# Altium project Kasli.PrjPCB (part 6 of 6)

## Sheet USB_Serial_Quad.SchDoc: =ProjectName
size 420 x 297 mm; Author: Paweł Kulik; DrawnBy: Paweł Kulik; Address1: Warsaw Univeristy of Technology; Address2: Nowowiejska 15/19; DocumentNumber: 12; Revision: 2.0; SheetNumber: 10; SheetTotal: 11; EDA_Number: ARTIQ; Projet: ARTIQ/SINARA; ModifiedBy: -; CheckedDate: -; Title2: USB_Serial_Quad.SchDoc; DivGrp: ISE; Designer: Paweł Kulik; ProjectName: ARTIQ/SINARA
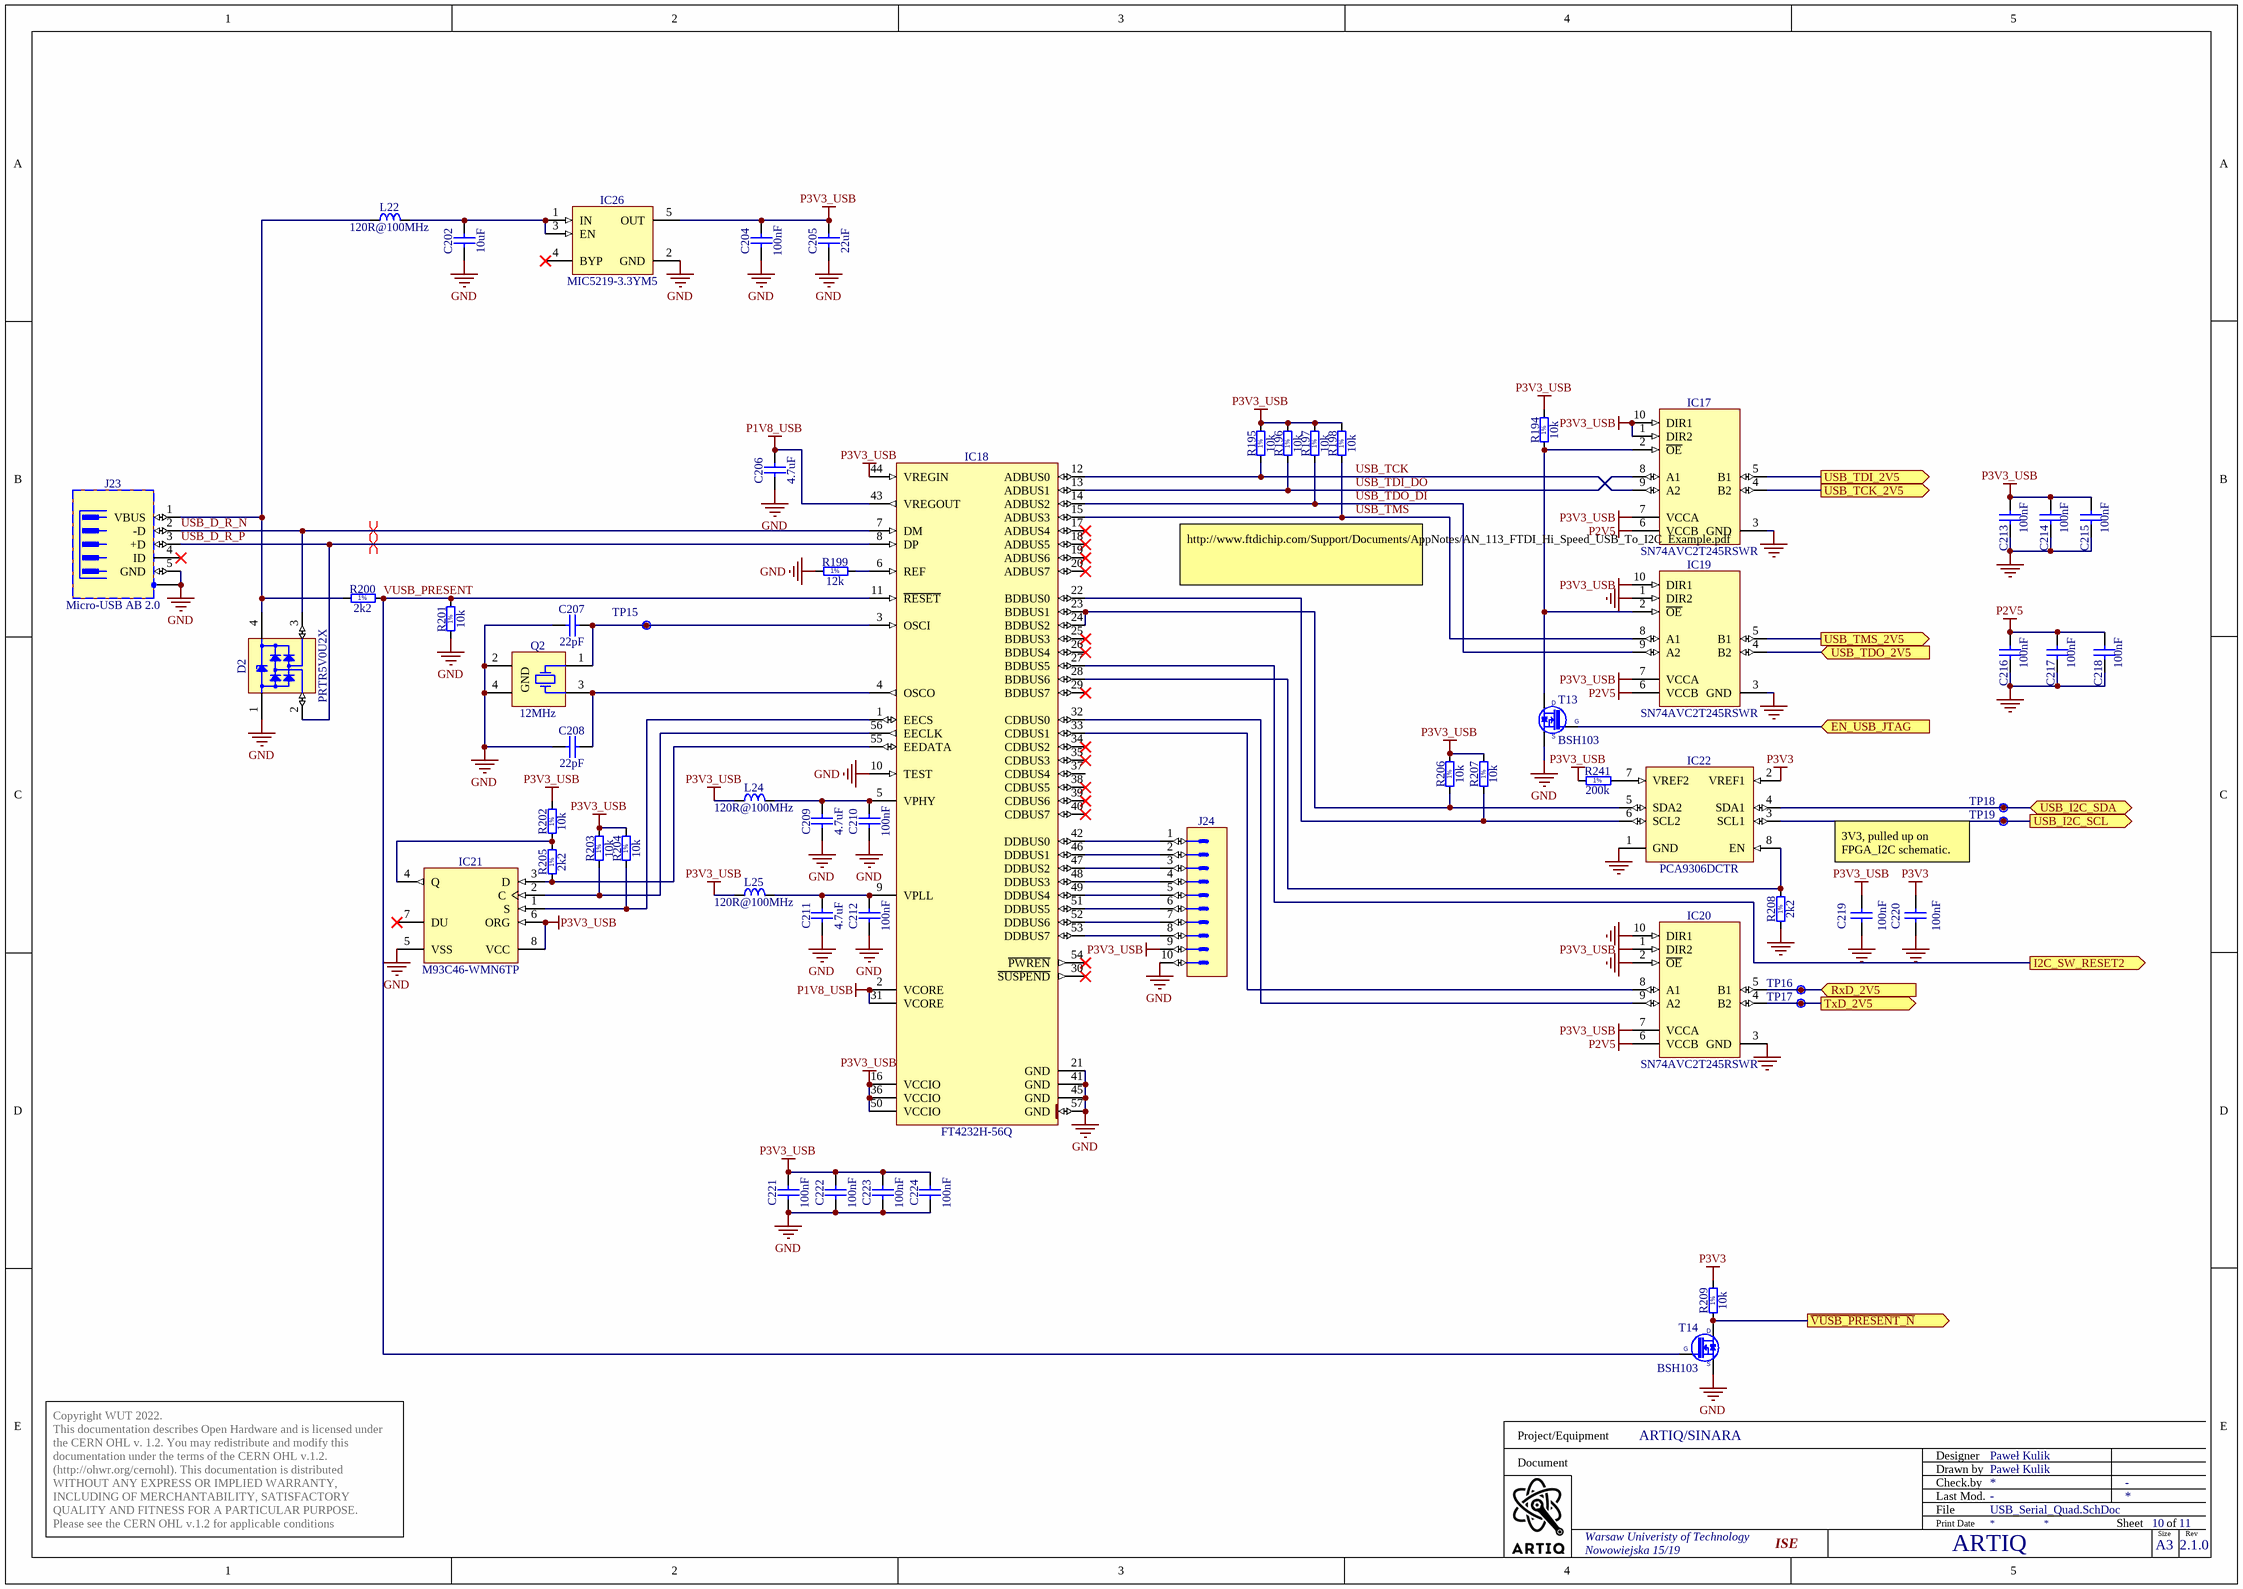
[diagram p10: USB_Serial_Quad.SchDoc]

### Parts
C202  10uF  [CAPC1608X87N]
C204  100nF  [CAPC0603X33N]
C205  22uF  [CAPC1709X100N]
C206  4.7uF  [CAPC2012X135N]
C207  22pF  [CAPC1005X55N]
C208  22pF  [CAPC1005X55N]
C209  4.7uF  [CAPC2012X135N]
C210  100nF  [CAPC0603X33N]
C211  4.7uF  [CAPC2012X135N]
C212  100nF  [CAPC0603X33N]
C213  100nF  [CAPC0603X33N]
C214  100nF  [CAPC0603X33N]
C215  100nF  [CAPC0603X33N]
C216  100nF  [CAPC0603X33N]
C217  100nF  [CAPC0603X33N]
C218  100nF  [CAPC0603X33N]
C219  100nF  [CAPC0603X33N]
C220  100nF  [CAPC0603X33N]
C221  100nF  [CAPC0603X33N]
C222  100nF  [CAPC0603X33N]
C223  100nF  [CAPC0603X33N]
C224  100nF  [CAPC0603X33N]
D2  PRTR5V0U2X  [SOT190P230X110-4N]
IC17  SN74AVC2T245RSWR  [QFN40P140X180X55-10N]
IC18  FT4232H-56Q  [QFN50P800X800X100-57N-S620]
IC19  SN74AVC2T245RSWR  [QFN40P140X180X55-10N]
IC20  SN74AVC2T245RSWR  [QFN40P140X180X55-10N]
IC21  M93C46-WMN6TP  [SOIC127P600X175-8N]
IC22  PCA9306DCTR  [SOP65P400X130-8N]
IC26  MIC5219-3.3YM5  [SOT95P280X145-5N]
J23  Micro-USB AB 2.0  [HIROSE_ZX62RD-AB-5P8]
J24  Header 10  [SAMTEC_TSW-105-07-L-D-LL]  (value not drawn)
L22  120R@100MHz  [INDC1608X65N]
L24  120R@100MHz  [INDC1608X65N]
L25  120R@100MHz  [INDC1608X65N]
Q2  12MHz  [XTAL_TXC_7M]
R194  10k  [RESC1005X40N]
R195  10k  [RESC1005X40N]
R196  10k  [RESC1005X40N]
R197  10k  [RESC1005X40N]
R198  10k  [RESC1005X40N]
R199  12k  [RESC1005X40N]
R200  2k2  [RESC1005X40N]
R201  10k  [RESC1005X40N]
R202  10k  [RESC1005X40N]
R203  10k  [RESC1005X40N]
R204  10k  [RESC1005X40N]
R205  2k2  [RESC1005X40N]
R206  10k  [RESC1005X40N]
R207  10k  [RESC1005X40N]
R208  2k2  [RESC1005X40N]
R209  10k  [RESC1005X40N]
R241  200k  [RESC1005X40N]
T13  BSH103  [SOT95P230X110-3N]
T14  BSH103  [SOT95P230X110-3N]
TP15  Q2  [TPS127]  (value not drawn)
TP16  RxD  [TPS127]  (value not drawn)
TP17  TxD  [TPS127]  (value not drawn)
TP18  USB I2C SDA  [TPS127]  (value not drawn)
TP19  USB I2C SCL  [TPS127]  (value not drawn)

### Ports
EN_USB_JTAG (in), I2C_SW_RESET2 (out), RxD_2V5 (in), TxD_2V5 (out), USB_I2C_SCL (out), USB_I2C_SDA (bidir), USB_TCK_2V5 (out), USB_TDI_2V5 (out), USB_TDO_2V5 (in), USB_TMS_2V5 (out), ~{VUSB_PRESENT_N} (out)

### Nets
GND: C202.1 C204.1 C205.1 C206.1 C207.1 C208.1 C209.1 C210.1 C211.1 C212.1 C213.1 C214.1 C215.1 C216.1 C217.1 C218.1 C219.1 C220.1 C221.1 C222.1 C223.1 C224.1 D2.1(GND) IC17.3(GND) IC18.10(TEST) IC18.21(GND) IC18.41(GND) IC18.45(GND) IC18.57(GND) IC19.1(DIR2) IC19.3(GND) IC20.2(~{OE}) IC20.3(GND) IC20.10(DIR1) IC21.5(VSS) IC22.1(GND) IC26.2(GND) J23.5(GND) J23.6(SH) J24.10 Q2.2(GND) Q2.4(GND) R199.1 R201.1 R208.1 T13.2(S) T14.2(S)
P1V8_USB: C206.2 IC18.2(VCORE) IC18.31(VCORE) IC18.43(VREGOUT)
P2V5: C216.2 C217.2 C218.2 IC17.6(VCCB) IC19.6(VCCB) IC20.6(VCCB)
P3V3: C220.2 IC22.2(VREF1) R209.2
P3V3_USB: C204.2 C205.2 C213.2 C214.2 C215.2 C219.2 C221.2 C222.2 C223.2 C224.2 IC17.1(DIR2) IC17.7(VCCA) IC17.10(DIR1) IC18.16(VCCIO) IC18.36(VCCIO) IC18.44(VREGIN) IC18.50(VCCIO) IC19.7(VCCA) IC19.10(DIR1) IC20.1(DIR2) IC20.7(VCCA) IC21.6(ORG) IC21.8(VCC) IC26.5(OUT) J24.9 L24.1 L25.1 R194.2 R195.2 R196.2 R197.2 R198.2 R202.2 R203.2 R204.2 R206.2 R207.2 R241.1
~{VUSB_PRESENT_N}: R209.1 T14.3(D) ; port ~{VUSB_PRESENT_N}
CFG_TCK: IC17.4(B2) ; port USB_TCK_2V5
CFG_TDI: IC17.5(B1) ; port USB_TDI_2V5
CFG_TDO: IC19.4(B2) ; port USB_TDO_2V5
CFG_TMS: IC19.5(B1) ; port USB_TMS_2V5
I2C_3V3_SW_SCL: IC22.3(SCL1) TP19.1 ; port USB_I2C_SCL
I2C_3V3_SW_SDA: IC22.4(SDA1) TP18.1 ; port USB_I2C_SDA
I2C_SW_RESET2: IC18.27(BDBUS5) ; port I2C_SW_RESET2
RxD_2V5: IC20.5(B1) TP16.1 ; port RxD_2V5
TxD_2V5: IC20.4(B2) TP17.1 ; port TxD_2V5
USB_D_R_N: D2.3(I/O2) IC18.7(DM) J23.2(-D)
USB_D_R_P: D2.2(I/O1) IC18.8(DP) J23.3(+D)
USB_TCK: IC17.9(A2) IC18.12(ADBUS0) R195.1
USB_TDI_DO: IC17.8(A1) IC18.13(ADBUS1) R196.1
USB_TDO_DI: IC18.14(ADBUS2) IC19.9(A2) R197.1
USB_TMS: IC18.15(ADBUS3) IC19.8(A1) R198.1
VUSB_PRESENT: IC18.11(~{RESET}) R200.2 R201.2 T14.1(G)
NetC53_2: T13.1(G) ; port EN_USB_JTAG
NetC202_2: C202.2 IC26.1(IN) IC26.3(EN) L22.2
NetC207_2: C207.2 IC18.3(OSCI) Q2.1(X) TP15.1
NetC208_2: C208.2 IC18.4(OSCO) Q2.3(X)
NetC209_2: C209.2 C210.2 IC18.5(VPHY) L24.2
NetC211_2: C211.2 C212.2 IC18.9(VPLL) L25.2
NetD2_4: D2.4(VCC) J23.1(VBUS) L22.1 R200.1
NetIC17_2: IC17.2(~{OE}) IC19.2(~{OE}) R194.1 T13.3(D)
NetIC18_1: IC18.1(EECS) IC21.1(S) R204.1
NetIC18_6: IC18.6(REF) R199.2
NetIC18_22: IC18.22(BDBUS0) IC22.6(SCL2) R207.1
NetIC18_23: IC18.23(BDBUS1) IC18.24(BDBUS2) IC22.5(SDA2) R206.1
NetIC18_28: IC18.28(BDBUS6) IC22.8(EN) R208.2
NetIC18_32: IC18.32(CDBUS0) IC20.9(A2)
NetIC18_33: IC18.33(CDBUS1) IC20.8(A1)
NetIC18_42: IC18.42(DDBUS0) J24.1
NetIC18_46: IC18.46(DDBUS1) J24.2
NetIC18_47: IC18.47(DDBUS2) J24.3
NetIC18_48: IC18.48(DDBUS3) J24.4
NetIC18_49: IC18.49(DDBUS4) J24.5
NetIC18_51: IC18.51(DDBUS5) J24.6
NetIC18_52: IC18.52(DDBUS6) J24.7
NetIC18_53: IC18.53(DDBUS7) J24.8
NetIC18_55: IC18.55(EEDATA) IC21.3(D) R205.2
NetIC18_56: IC18.56(EECLK) IC21.2(C) R203.1
NetIC21_4: IC21.4(Q) R202.1 R205.1
NetIC22_7: IC22.7(VREF2) R241.2

Not connected (* = marked no-connect by the designer): IC18 17(ADBUS4)* 18(ADBUS5)* 19(ADBUS6)* 20(ADBUS7)* 25(BDBUS3)* 26(BDBUS4)* 29(BDBUS7)* 30(~{SUSPEND})* 34(CDBUS2)* 35(CDBUS3)* 37(CDBUS4) 38(CDBUS5)* 39(CDBUS6)* 40(CDBUS7)* 54(~{PWREN})*; IC21 7(DU)*; IC26 4(BYP)*; J23 4(ID)*

### Layout directives
differential pair; differential pair class Diff_90Ohm: USB_D_R_N, USB_D_R_P

### Notes on the sheet
- http://www.ftdichip.com/Support/Documents/AppNotes/AN_113_FTDI_Hi_Speed_USB_To_I2C_Example.pdf
- 3V3, pulled up on FPGA_I2C schematic.
- Project/Equipment
- Document
- Designer
- Drawn by
- Check.by
- Copyright WUT 2022.
  This documentation describes Open Hardware and is licensed under the CERN OHL v. 1.2. You may redistribute and modify this documentation under the terms of the CERN OHL v.1.2. (http://ohwr.org/cernohl). This documentation is distributed WITHOUT ANY EXPRESS OR IMPLIED WARRANTY, INCLUDING OF MERCHANTABILITY, SATISFACTORY QUALITY AND FITNESS FOR A PARTICULAR PURPOSE. Please see the CERN OHL v.1.2 for applicable conditions
- File
- Last Mod.
- Print Date
- Sheet
- Size
- A3
- of
- Rev
- (in symbol R0402_2K2_1%_0.0625W_100PPM) 1%
- (in symbol R0402_10K_1%_0.0625W_100PPM) 1%
- (in symbol R0402_12K_1%_0.0625W_100PPM) 1%
- (in symbol R0402_200K_1%_0.0625W_100PPM) 1%

### Library data of the parts
C202 = CC0603_10UF_6.3V_20%_X5R: Non-polarised capacitor; Part Description: SMD Multilayer Chip Ceramic Capacitor; Manufacturer: GENERIC; Manufacturer1 Part Number: C0603C106M9PAC; Voltage: 6.3V; TC: X5R; Tolerance: ±20%; Part Number: CC0603_10UF_6.3V_20%_X5R; Component Kind: Standard; Component Type: Standard; Pin Count: 2; Value: 10uF; Status: Preferred; Manufacturer Part Number: CC0603_10uF_6.3V_20%_X5R; Case: 0603; Mounted: Yes; Socket: No; SMD: Yes; Sense: No; Manufacturer1 Example: KEMET; Manufacturer1 ComponentHeight: 0.95mm; HelpURL: \\cern.ch\dfs\Applications\Altium\Datasheets\CC0603_X5R_KEMET.pdf; Author: CERN DEM JLC; CreateDate: 2007-12-03; LatestRevisionDate: 2007-12-03
C204 C210 C212-C224 = CC0201_100NF_6.3V_10%_X5R: as C30-C37 on sheet IDC_EXT_Connectors; Part Number: CC0201_100NF_6.3V_10%_X5R; Component Kind: Standard; Component Type: Standard; Pin Count: 2; Value: 100nF; Status: Not Recommended; Manufacturer Part Number: CC0201_100NF_6.3V_10%_X5R; Case: 0201; Mounted: Yes; Socket: No; SMD: Yes; Sense: No; Manufacturer1 Example: AVX; Manufacturer1 ComponentHeight: 0.33mm; HelpURL: \\cern.ch\dfs\Applications\Altium\Datasheets\CC0201_X5R_AVX.pdf; Author: CERN DEM JLC
  C204 C210 C212 C221-C224: CreateDate: 03.12.2007; LatestRevisionDate: 03.12.2007
  C213-C220: CreateDate: 2007-12-03; LatestRevisionDate: 2007-12-03
C205 = CC0603_22UF_6.3V_20%_X5R: Non-polarised capacitor; Part Description: SMD Multilayer Chip Ceramic Capacitor; Manufacturer: GENERIC; Manufacturer1 Part Number: C1608X5R0J226M080AC; Voltage: 6.3V; TC: X5R; Tolerance: ±20%; Part Number: CC0603_22UF_6.3V_20%_X5R; Component Kind: Standard; Component Type: Standard; Pin Count: 2; Value: 22uF; Status: None; Manufacturer Part Number: CC0603_22UF_6.3V_20%_X5R; Case: 0603; Mounted: Yes; Socket: No; SMD: Yes; Sense: No; Manufacturer1 Example: TDK; Manufacturer1 ComponentHeight: 1mm; HelpURL: \\cern.ch\dfs\Applications\Altium\Datasheets\CC0603_X5R_TDK_C.pdf; Author: CERN DEM JLC; CreateDate: 16.12.2013; LatestRevisionDate: 13.09.2016; ClassName: Artix
C206 C209 C211 = CC0805_4.7UF_10V_10%_X5R: Non-polarised capacitor; Part Description: SMD Multilayer Chip Ceramic Capacitor; Manufacturer: GENERIC; Manufacturer1 Part Number: 222224013672; Voltage: 10V; TC: X5R; Tolerance: ±10%; Part Number: CC0805_4.7UF_10V_10%_X5R; Component Kind: Standard; Component Type: Standard; Pin Count: 2; Value: 4.7uF; Status: Preferred; Manufacturer Part Number: CC0805_4.7UF_10V_10%_X5R; Case: 0805; Mounted: Yes; Socket: No; SMD: Yes; Sense: No; Manufacturer1 Example: PHYCOMP; Manufacturer1 ComponentHeight: 1.45mm; HelpURL: \\cern.ch\dfs\Applications\Altium\Datasheets\CC0805_X5R_PHYCOMP_HC.pdf; Author: CERN DEM JLC; CreateDate: 03.12.2007; LatestRevisionDate: 03.12.2007
C207 C208 = CC0402_22PF_50V_5%_C0G: Non-polarised capacitor; Part Description: SMD Multilayer Chip Ceramic Capacitor; Manufacturer: GENERIC; Manufacturer1 Part Number: C0402C220J5GACTU; Voltage: 50V; TC: C0G/NP0; Tolerance: ±5%; Part Number: CC0402_22PF_50V_5%_C0G; Component Kind: Standard; Component Type: Standard; Pin Count: 2; Value: 22pF; Status: Preferred; Manufacturer Part Number: CC0402_22PF_50V_5%_C0G; Case: 0402; Mounted: Yes; Socket: No; SMD: Yes; Sense: No; Manufacturer1 Example: KEMET; Manufacturer1 ComponentHeight: 0.55mm; HelpURL: \\cern.ch\dfs\Applications\Altium\Datasheets\CC0805_C0G_KEMET_(Commercial Grade).pdf; Author: CERN DEM JLC; CreateDate: 03.12.2007; LatestRevisionDate: 03.12.2007
D2 = PRTR5V0U2X: as D3-D14 on sheet IDC_EXT_Connectors; Part Number: PRTR5V0U2X; Component Kind: Standard; Component Type: Standard; Device: PRTR5V0U2X; PackageDescription: SOT143B, SOT, 1.90mm Pitch; 4 Pin, 1.30mm W X 2.90mm L X 1.10mm H body, IPC Medium Density; Manufacturer Part Number: PRTR5V0U2X; Pin Count: 4; Case: SOT143B; Mounted: Yes; Socket: No; SMD: Yes; Sense: No; ComponentHeight: 1.1mm; HelpURL: \\cern.ch\dfs\Applications\Altium\Datasheets\PRTR5V0U2X.pdf; Author: CERN DEM JLC; CreateDate: 22.03.2011; LatestRevisionDate: 22.03.2011
IC17 IC19 IC20 = SN74AVC2T245RSWR: Dual-Bit Dual-Supply Bus Transceiver With Configurable Voltage Translation and 3-State Outputs; Manufacturer: TEXAS INSTRUMENTS; PressFit: No; Bonding: No; Part Number: SN74AVC2T245RSWR; Component Kind: Standard; Component Type: Standard; Device: SN74AVC2T245RSWR; PackageDescription: QFN, 0.40mm Pitch, Rect.;10 Pin, 1.80mm L X 1.40mm W X 0.55mm H Body, IPC Medium Density; Status: Not Recommended; Part Description: Dual-Bit Dual-Supply Bus Transceiver With Configurable Voltage Translation and 3-State Outputs; Manufacturer Part Number: SN74AVC2T245RSWR; Pin Count: 10; Case: QFN10; Mounted: Yes; Socket: No; SMD: Yes; Sense: No; ComponentHeight: 0.55mm; Author: CERN DEM JLC; HelpURL: \\cern.ch\dfs\Applications\Altium\Datasheets\SN74AVC2T245RSWR.pdf; CreateDate: 07.07.2014; LatestRevisionDate: 30.03.2017
IC18 = FT4232H-56Q: Quad High Speed USB to Multipurpose UART/MPSSE IC; Manufacturer: FUTURE TECHNOLOGY DEVICES INTERNATIONAL (FTDI); PressFit: No; Bonding: No; Part Number: FT4232H-56Q; Component Kind: Standard; Component Type: Standard; Device: FT4232H-56Q; PackageDescription: QFN, 0.50mm Pitch, Square; 56 Pin, 8.00mm L X 8.00mm W X 1.00mm H body (6.1mm X 6.1mm Thermal tab), IPC Medium Density; Part Description: Quad High Speed USB to Multipurpose UART/MPSSE IC; Manufacturer Part Number: FT4232H-56Q; Pin Count: 57; Case: QFN56; Mounted: Yes; Socket: No; SMD: Yes; Sense: No; ComponentHeight: 1mm; Author: CERN DEM JLC; HelpURL: \\cern.ch\dfs\Applications\Altium\Datasheets\FT4232H-56Q.pdf; CreateDate: 11.10.2016; LatestRevisionDate: 11.10.2016
IC21 = M93C46-WMN6TP: 2.5 to 5.5 V, 1Kb (128x8) Serial Microwire Bus EEPROM; Part Description: 1Kbit (128 x 8 bit or 64 x 16 bit) MICROWIRE® Serial Access EEPROM; Manufacturer: ST MICROELECTRONICS; PressFit: No; Bonding: No; Part Number: M93C46-WMN6TP; Component Kind: Standard; Component Type: Standard; Device: M93C46-WMN6TP; PackageDescription: SOIC 8, Pitch 1.27mm - Body 4x5mm, IPC Medium Density; Manufacturer Part Number: M93C46-WMN6TP; Pin Count: 8; Case: SOIC8; Mounted: Yes; Socket: No; SMD: Yes; Sense: No; ComponentHeight: 1.75mm; HelpURL: \\cern.ch\dfs\Applications\Altium\Datasheets\M93C46-WMN6TP.pdf; Author: CERN DEM JLC; CreateDate: 15.11.2012; LatestRevisionDate: 15.11.2012
IC22 = PCA9306DCTR: Dual Bidirectional I2C Bus And SMBus Voltage-Level Translator; Manufacturer: TEXAS INSTRUMENTS; PressFit: No; Bonding: No; Part Number: PCA9306DCTR; Component Kind: Standard; Component Type: Standard; Device: PCA9306DCTR; PackageDescription: SOP, 0.65mm, Pitch; 8 Pin, 2.80mm W X 2.95mm L X 1.30mm H Body, PC Medium Density; Part Description: Dual Bidirectional I2C Bus And SMBus Voltage-Level Translator; Manufacturer Part Number: PCA9306DCTR; Pin Count: 8; Case: SSOP8; Mounted: Yes; Socket: No; SMD: Yes; Sense: No; ComponentHeight: 1.3mm; Author: CERN DEM JLC; HelpURL: \\cern.ch\dfs\Applications\Altium\Datasheets\PCA9306DCTR.pdf; CreateDate: 25.02.2013; LatestRevisionDate: 11.02.2016
IC26 = MIC5219-3.3YM5: 500mA Peak Output LDO Regulator; Part Description: 3.3V 500mA Peak Output Low Drop-Out  (LDO) Regulator; Manufacturer: MICROCHIP TECHNOLOGY; PressFit: No; Bonding: No; Part Number: MIC5219-3.3YM5; Component Kind: Standard; Component Type: Standard; Device: MIC5219-3.3YM5; PackageDescription: SOT, 0.95mm pitch; 5 pin, 1.60mm W X 2.90mm L X 1.45mm H body, IPC Medium Density; Manufacturer Part Number: MIC5219-3.3YM5; Pin Count: 5; Case: SOT23-5; Mounted: Yes; Socket: No; SMD: Yes; Sense: No; ComponentHeight: 1.45mm; HelpURL: \\cern.ch\dfs\Applications\Altium\Datasheets\MIC5219-3.3YM5.pdf; Author: CERN DEM WB; CreateDate: 2019-04-16; LatestRevisionDate: 2019-04-16
J23 = HIROSE_ZX62RD-AB-5P8: 5 Pin + 1 Shield USB Receptacle; Part Description: Micro-USB 2.0 Right Angle, SMD Type AB - Reverse (Top mount), Shell Through Hole; Manufacturer: HIROSE (HRS); PressFit: No; Part Number: HIROSE_ZX62RD-AB-5P8; Component Kind: Standard; Component Type: Standard; Pin Count: 7; Family: Micro-USB AB 2.0; Mounted: Yes; Socket: No; SMD: Yes; Sense: No; Status: None; Manufacturer Part Number: ZX62RD-AB-5P8; ComponentHeight: 2.35mm; HelpURL: \\cern.ch\dfs\Applications\Altium\Datasheets\HIROSE_ZX62RD-AB-5P8.pdf; ComponentLink1URL: \\cern.ch\dfs\Applications\Altium\Datasheets\HIROSE_ZX62RD-AB-5P8_Package-Drawing.pdf; ComponentLink1Description: Package-Drawing; Author: CERN DEM JLC; CreateDate: 29.10.2014; LatestRevisionDate: 29.10.2014; ClassName: Connectors
J24 = SAMTEC_TSW-105-07-L-D-LL: Connector 10 Male; Part Description: 10 Contacts, Pitch 2.54mm, Dual Row Through Mount  Straight Header With Locking Lead (Lead Length 2.54mm); Manufacturer: SAMTEC; PressFit: No; Part Number: SAMTEC_TSW-105-07-L-D-LL; Component Kind: Standard; Component Type: Standard; Pin Count: 10; Family: Header 10; Mounted: Yes; Socket: No; SMD: No; Sense: No; Status: None; Manufacturer Part Number: TSW-105-07-L-D-LL; ComponentHeight: 8.38mm; HelpURL: \\cern.ch\dfs\Applications\Altium\Datasheets\SAMTEC_TSW-105-07-L-D-LL.pdf; Author: CERN DEM JLC; CreateDate: 2012-01-23; LatestRevisionDate: 2012-07-26
L22 L24 L25 = IND0603_MURATA_BLM18SG121TN1D: Inductor; Part Description: SMD EMIFIL Suppression Chip Ferrite Bead; Manufacturer: MURATA; Power: 3A; Resistance: 0.025R; Tolerance: ±25%; Part Number: IND0603_MURATA_BLM18SG121TN1D; Component Kind: Standard; Component Type: Standard; Pin Count: 2; Value: 120R@100MHz; Status: None; Manufacturer Part Number: BLM18SG121TN1D; Case: 0603; Mounted: Yes; Socket: No; SMD: Yes; Sense: No; ComponentHeight: 0.65mm; HelpURL: \\cern.ch\dfs\Applications\Altium\Datasheets\IND0603_MURATA_BLM18S.pdf; Author: CERN DEM JLC; CreateDate: 23.07.2014; LatestRevisionDate: 23.07.2014
Q2 = XTAL_12MHZ_TXC_7M-12.000MAAJ-T: Crystal 4 pins 1=XTAL Control 2=GND3=XTAL 4=GND; Part Description: ±30ppm 18pF -20°C to +70°C  4 Pins, 3.2x2.5X0.8mm, SMD Sealing Crystal, 7M Series; Manufacturer: TXC CORPORATION; PressFit: No; Bonding: No; Part Number: XTAL_12MHZ_TXC_7M-12.000MAAJ-T; Component Kind: Standard; Component Type: Standard; PackageDescription: 4 Pins, 2.5x3.2mm, SMD Sealing Crystal, 7M Serie; Value: 12MHz; Manufacturer Part Number: 7M-12.000MAAJ-T; Pin Count: 4; Mounted: Yes; Socket: No; SMD: Yes; Sense: No; ComponentHeight: 0.8mm; HelpURL: \\cern.ch\dfs\Applications\Altium\Datasheets\XTAL_TXC_7M.pdf; Author: CERN DEM JLC; CreateDate: 19.06.2012; LatestRevisionDate: 19.06.2012
R194-R198 R201-R204 R206 R207 R209 = R0402_10K_1%_0.0625W_100PPM: Resistor - 1%; Part Description: General Purpose Thick Film Chip Resistor; Manufacturer: GENERIC; Manufacturer1 Part Number: 232270671003L; TC: ±100ppm/°C; PressFit: No; Part Number: R0402_10K_1%_0.0625W_100PPM; Component Kind: Standard; Component Type: Standard; Pin Count: 2; Value: 10k; Status: Not Recommended; Power: 0.0625W; Tolerance: ±1%; Manufacturer Part Number: R0402_10K_1%_0.0625W_100PPM; Case: 0402; Mounted: Yes; Socket: No; SMD: Yes; Manufacturer1 Example: YAGEO PHYCOMP; Manufacturer1 ComponentHeight: 0.4mm; HelpURL: \\cern.ch\dfs\Applications\Altium\Datasheets\R0402_Phycomp_RC0402.pdf; Author: CERN DEM JLC; CreateDate: 03.12.2007; LatestRevisionDate: 17.10.2012; Sense: No
R199 = R0402_12K_1%_0.0625W_100PPM: Resistor - 1%; Part Description: General Purpose Thick Film Chip Resistor; Manufacturer: GENERIC; Manufacturer1 Part Number: 232270671203L; TC: ±100ppm/°C; PressFit: No; Part Number: R0402_12K_1%_0.0625W_100PPM; Component Kind: Standard; Component Type: Standard; Pin Count: 2; Value: 12k; Status: Not Recommended; Power: 0.0625W; Tolerance: ±1%; Manufacturer Part Number: R0402_12K_1%_0.0625W_100PPM; Case: 0402; Mounted: Yes; Sense: No; Socket: No; SMD: Yes; Manufacturer1 Example: YAGEO PHYCOMP; Manufacturer1 ComponentHeight: 0.4mm; HelpURL: \\cern.ch\dfs\Applications\Altium\Datasheets\R0402_Phycomp_RC0402.pdf; Author: CERN DEM JLC; CreateDate: 03.12.2007; LatestRevisionDate: 17.10.2012
R200 R205 R208 = R0402_2K2_1%_0.0625W_100PPM: Resistor - 1%; Part Description: General Purpose Thick Film Chip Resistor; Manufacturer: GENERIC; Manufacturer1 Part Number: 232270672202L; TC: ±100ppm/°C; PressFit: No; Part Number: R0402_2K2_1%_0.0625W_100PPM; Component Kind: Standard; Component Type: Standard; Pin Count: 2; Value: 2k2; Status: Not Recommended; Power: 0.0625W; Tolerance: ±1%; Manufacturer Part Number: R0402_2K2_1%_0.0625W_100PPM; Case: 0402; Mounted: Yes; Sense: No; Socket: No; SMD: Yes; Manufacturer1 Example: YAGEO PHYCOMP; Manufacturer1 ComponentHeight: 0.4mm; HelpURL: \\cern.ch\dfs\Applications\Altium\Datasheets\R0402_Phycomp_RC0402.pdf; Author: CERN DEM JLC; CreateDate: 03.12.2007; LatestRevisionDate: 17.10.2012
R241 = R0402_200K_1%_0.0625W_100PPM: Resistor - 1%; Part Description: General Purpose Thick Film Chip Resistor; Manufacturer: GENERIC; Manufacturer1 Part Number: 232270672004L; TC: ±100ppm/°C; PressFit: No; Part Number: R0402_200K_1%_0.0625W_100PPM; Component Kind: Standard; Component Type: Standard; Pin Count: 2; Value: 200k; Status: Not Recommended; Power: 0.0625W; Tolerance: ±1%; Manufacturer Part Number: R0402_200K_1%_0.0625W_100PPM; Case: 0402; Mounted: Yes; Sense: No; Socket: No; SMD: Yes; Manufacturer1 Example: YAGEO PHYCOMP; Manufacturer1 ComponentHeight: 0.4mm; HelpURL: \\cern.ch\dfs\Applications\Altium\Datasheets\R0402_Phycomp_RC0402.pdf; Author: CERN DEM JLC; CreateDate: 03.12.2007; LatestRevisionDate: 17.10.2012
T13 T14 = BSH103: N-CHANNEL MOSFET WITH DIODE; Part Description: 30V 850mA N-Channel Enhancement Mode Field-Effect Transistor; Manufacturer: NEXPERIA; PressFit: No; Bonding: No; Part Number: BSH103; Component Kind: Standard; Component Type: Standard; Device: BSH103; PackageDescription: SOT23, 3 pin, Pitch 0.95mm - 1.3mm W X 2.9mm L X 1.1mm H, IPC Medium Density; Manufacturer Part Number: BSH103; Pin Count: 3; Case: SOT23-3; Mounted: Yes; Socket: No; SMD: Yes; Sense: No; ComponentHeight: 1.1mm; HelpURL: \\cern.ch\dfs\Applications\Altium\Datasheets\BSH103.pdf; Author: CERN DEM JLC; CreateDate: 16.03.2010; LatestRevisionDate: 20.06.2017
TP15-TP19 = SMD_PAD_1.27X1.27MM: Test Point; Part Description: 1.27mm x 1.27mm PCB Copper Area (SMD Test Point); Mounted: No; Part Number: SMD_PAD_1.27X1.27MM; Component Kind: Standard (No BOM); Component Type: Standard (No BOM); Pin Count: 1; Family: Test Point; Socket: No; SMD: Yes; Sense: No; Status: None; ComponentHeight: 0mm; HelpURL: Undefined; Author: CERN DEM JLC; CreateDate: 12.01.2008; LatestRevisionDate: 12.01.2008; PackageDescription: 1.27mm x 1.27mm PCB Copper Area (SMD Test Point)

## Nets that join several sheets
GND: TOP (6 pins), FPGA (14 pins), ClockRecovery (122 pins), PowerSupplies (85 pins), SFP (69 pins), FPGAPower&Misc (178 pins), FPGAGTP (C238.1 OSC2.3), FPGA_I2C (48 pins), FPGA_SDRAM (45 pins), IDC_EXT_Connectors (132 pins), USB_Serial_Quad (47 pins)
MGTAVCC: PowerSupplies (C148.2 L15.2), FPGAPower&Misc (10 pins)
MGTAVTT: PowerSupplies (L18.2), FPGAPower&Misc (13 pins), FPGAGTP (R191.1)
P1V0: PowerSupplies (7 pins), FPGAPower&Misc (29 pins)
P1V5: PowerSupplies (L17.2 T9.1 TP10.1), FPGAPower&Misc (14 pins), FPGA_SDRAM (29 pins)
P1V8: PowerSupplies (8 pins), FPGAPower&Misc (L4.1)
P2V5: TOP (6 pins), FPGA (5 pins), ClockRecovery (10 pins), PowerSupplies (8 pins), FPGAPower&Misc (66 pins), FPGAGTP (C238.2 OSC2.2 OSC2.6), FPGA_I2C (12 pins), USB_Serial_Quad (6 pins)
P3V3: TOP (C161.2 IC16.2), FPGA (5 pins), ClockRecovery (16 pins), PowerSupplies (14 pins), SFP (32 pins), FPGAPower&Misc (R55.2), FPGA_I2C (59 pins), FPGA_SDRAM (C172.2 IC9.7 IC9.10 R127.2), IDC_EXT_Connectors (24 pins), USB_Serial_Quad (C220.2 IC22.2 R209.2)
P3V3_EEM: PowerSupplies (C310.2 D21.1 IC32.5), IDC_EXT_Connectors (12 pins)
P12V0: ClockRecovery (L39.1), PowerSupplies (17 pins)
P12V0_EEM: PowerSupplies (C314.2 D22.1 IC33.5), IDC_EXT_Connectors (24 pins)
P12V0_SMPS: FPGA (D18.1 J21.2), PowerSupplies (13 pins)
VCCAUX: PowerSupplies (C233.2 L26.2), FPGAPower&Misc (13 pins)
VCCBRAM: PowerSupplies (C149.2 L13.2), FPGAPower&Misc (8 pins)
~{VUSB_PRESENT_N}: FPGA_I2C (IC25.27 IC29.10), USB_Serial_Quad (R209.1 T14.3)
ASSY_Variant: FPGA (IC4.P15), FPGA_I2C (R271.1 R272.2)
CFG_CCLK: TOP (IC16.16), FPGAPower&Misc (IC4.L12)
CFG_D02: TOP (IC16.9 R96.1), FPGA (IC4.P21)
CFG_D03: TOP (IC16.1 R94.1), FPGA (IC4.R21)
CFG_DIN: TOP (IC16.8), FPGA (IC4.R22)
CFG_FCS: TOP (IC16.7 R95.1), FPGA (IC4.T19)
CFG_MOSI: TOP (IC16.15), FPGA (IC4.P22)
CFG_TCK: FPGAPower&Misc (D15.3 IC4.V12 J8.6), USB_Serial_Quad (IC17.4)
CFG_TDI: FPGAPower&Misc (D16.3 IC4.R13 J8.10), USB_Serial_Quad (IC17.5)
CFG_TDO: FPGAPower&Misc (D16.2 IC4.U13 J8.8), USB_Serial_Quad (IC19.4)
CFG_TMS: FPGAPower&Misc (D15.2 IC4.T13 J8.4), USB_Serial_Quad (IC19.5)
CK_FPGAIO_N: FPGA (IC4.Y19), ClockRecovery (C6.2 R210.2 R211.2)
CK_FPGAIO_P: FPGA (IC4.Y18), ClockRecovery (C4.2 R1.2 R2.2)
CK_GTP_N: ClockRecovery (C11.2), FPGAGTP (IC4.E6)
CK_GTP_P: ClockRecovery (C8.2), FPGAGTP (IC4.F6)
CLK_SEL: ClockRecovery (IC1.32 R242.1 R243.2), FPGA_I2C (IC25.8 IC29.20)
CLK_SMA_IN_N: TOP (R13.2 TR1.3), FPGA (IC4.V20)
CLK_SMA_IN_P: TOP (R80.2 TR1.1), FPGA (IC4.U20 R9.2)
CLKREC_N: FPGA (IC4.T18), ClockRecovery (C2.1 R3.1)
CLKREC_P: FPGA (IC4.R18), ClockRecovery (C1.1 R3.2)
EEM_FLT_N: FPGA (IC4.V22 NT2.1 TP30.1), PowerSupplies (IC33.6)
EEM_PWR_EN: FPGA (IC4.U21 NT1.1 TP29.1), PowerSupplies (IC33.2 R262.2)
EEPROM_I2C_SCL: FPGA (IC4.P20), FPGA_I2C (IC30.1 IC31.6 R265.1)
EEPROM_I2C_SDA: FPGA (IC4.P19), FPGA_I2C (IC30.3 IC31.5 R264.1)
EXT0.LVDS_N0: FPGA (IC4.T4), IDC_EXT_Connectors (J9.3)
EXT0.LVDS_N1: FPGA (IC4.R2), IDC_EXT_Connectors (J9.6)
EXT0.LVDS_N2: FPGA (IC4.U1), IDC_EXT_Connectors (J9.9)
EXT0.LVDS_N3: FPGA (IC4.V2), IDC_EXT_Connectors (J9.12)
EXT0.LVDS_N4: FPGA (IC4.Y1), IDC_EXT_Connectors (J9.15)
EXT0.LVDS_N5: FPGA (IC4.Y2), IDC_EXT_Connectors (J9.18)
EXT0.LVDS_N6: FPGA (IC4.AB1), IDC_EXT_Connectors (J9.21)
EXT0.LVDS_N7: FPGA (IC4.AA4), IDC_EXT_Connectors (J9.24)
EXT0.LVDS_P0: FPGA (IC4.R4), IDC_EXT_Connectors (J9.2)
EXT0.LVDS_P1: FPGA (IC4.R3), IDC_EXT_Connectors (J9.5)
EXT0.LVDS_P2: FPGA (IC4.T1), IDC_EXT_Connectors (J9.8)
EXT0.LVDS_P3: FPGA (IC4.U2), IDC_EXT_Connectors (J9.11)
EXT0.LVDS_P4: FPGA (IC4.W1), IDC_EXT_Connectors (J9.14)
EXT0.LVDS_P5: FPGA (IC4.W2), IDC_EXT_Connectors (J9.17)
EXT0.LVDS_P6: FPGA (IC4.AA1), IDC_EXT_Connectors (J9.20)
EXT0.LVDS_P7: FPGA (IC4.Y4), IDC_EXT_Connectors (J9.23)
EXT1.LVDS_N0: FPGA (IC4.U5), IDC_EXT_Connectors (J10.3)
EXT1.LVDS_N1: FPGA (IC4.W7), IDC_EXT_Connectors (J10.6)
EXT1.LVDS_N2: FPGA (IC4.V3), IDC_EXT_Connectors (J10.9)
EXT1.LVDS_N3: FPGA (IC4.V8), IDC_EXT_Connectors (J10.12)
EXT1.LVDS_N4: FPGA (IC4.AB2), IDC_EXT_Connectors (J10.15)
EXT1.LVDS_N5: FPGA (IC4.T6), IDC_EXT_Connectors (J10.18)
EXT1.LVDS_N6: FPGA (IC4.V5), IDC_EXT_Connectors (J10.21)
EXT1.LVDS_N7: FPGA (IC4.AB5), IDC_EXT_Connectors (J10.24)
EXT1.LVDS_P0: FPGA (IC4.T5), IDC_EXT_Connectors (J10.2)
EXT1.LVDS_P1: FPGA (IC4.V7), IDC_EXT_Connectors (J10.5)
EXT1.LVDS_P2: FPGA (IC4.U3), IDC_EXT_Connectors (J10.8)
EXT1.LVDS_P3: FPGA (IC4.V9), IDC_EXT_Connectors (J10.11)
EXT1.LVDS_P4: FPGA (IC4.AB3), IDC_EXT_Connectors (J10.14)
EXT1.LVDS_P5: FPGA (IC4.R6), IDC_EXT_Connectors (J10.17)
EXT1.LVDS_P6: FPGA (IC4.U6), IDC_EXT_Connectors (J10.20)
EXT1.LVDS_P7: FPGA (IC4.AA5), IDC_EXT_Connectors (J10.23)
EXT2.LVDS_N0: FPGA (IC4.W4), IDC_EXT_Connectors (J11.3)
EXT2.LVDS_N1: FPGA (IC4.AA3), IDC_EXT_Connectors (J11.6)
EXT2.LVDS_N2: FPGA (IC4.W5), IDC_EXT_Connectors (J11.9)
EXT2.LVDS_N3: FPGA (IC4.Y7), IDC_EXT_Connectors (J11.12)
EXT2.LVDS_N4: FPGA (IC4.AA6), IDC_EXT_Connectors (J11.15)
EXT2.LVDS_N5: FPGA (IC4.AB6), IDC_EXT_Connectors (J11.18)
EXT2.LVDS_N6: FPGA (IC4.AB8), IDC_EXT_Connectors (J11.21)
EXT2.LVDS_N7: FPGA (IC4.Y9), IDC_EXT_Connectors (J11.24)
EXT2.LVDS_P0: FPGA (IC4.V4), IDC_EXT_Connectors (J11.2)
EXT2.LVDS_P1: FPGA (IC4.Y3), IDC_EXT_Connectors (J11.5)
EXT2.LVDS_P2: FPGA (IC4.W6), IDC_EXT_Connectors (J11.8)
EXT2.LVDS_P3: FPGA (IC4.Y8), IDC_EXT_Connectors (J11.11)
EXT2.LVDS_P4: FPGA (IC4.Y6), IDC_EXT_Connectors (J11.14)
EXT2.LVDS_P5: FPGA (IC4.AB7), IDC_EXT_Connectors (J11.17)
EXT2.LVDS_P6: FPGA (IC4.AA8), IDC_EXT_Connectors (J11.20)
EXT2.LVDS_P7: FPGA (IC4.W9), IDC_EXT_Connectors (J11.23)
EXT3.LVDS_N0: FPGA (IC4.L20), IDC_EXT_Connectors (J12.3)
EXT3.LVDS_N1: FPGA (IC4.L13), IDC_EXT_Connectors (J12.6)
EXT3.LVDS_N2: FPGA (IC4.M20), IDC_EXT_Connectors (J12.9)
EXT3.LVDS_N3: FPGA (IC4.K14), IDC_EXT_Connectors (J12.12)
EXT3.LVDS_N4: FPGA (IC4.L15), IDC_EXT_Connectors (J12.15)
EXT3.LVDS_N5: FPGA (IC4.M16), IDC_EXT_Connectors (J12.18)
EXT3.LVDS_N6: FPGA (IC4.L18), IDC_EXT_Connectors (J12.21)
EXT3.LVDS_N7: FPGA (IC4.N19), IDC_EXT_Connectors (J12.24)
EXT3.LVDS_P0: FPGA (IC4.L19), IDC_EXT_Connectors (J12.2)
EXT3.LVDS_P1: FPGA (IC4.M13), IDC_EXT_Connectors (J12.5)
EXT3.LVDS_P2: FPGA (IC4.N20), IDC_EXT_Connectors (J12.8)
EXT3.LVDS_P3: FPGA (IC4.K13), IDC_EXT_Connectors (J12.11)
EXT3.LVDS_P4: FPGA (IC4.L14), IDC_EXT_Connectors (J12.14)
EXT3.LVDS_P5: FPGA (IC4.M15), IDC_EXT_Connectors (J12.17)
EXT3.LVDS_P6: FPGA (IC4.M18), IDC_EXT_Connectors (J12.20)
EXT3.LVDS_P7: FPGA (IC4.N18), IDC_EXT_Connectors (J12.23)
EXT4.LVDS_N0: FPGA (IC4.V19), IDC_EXT_Connectors (J13.3)
EXT4.LVDS_N1: FPGA (IC4.Y22), IDC_EXT_Connectors (J13.6)
EXT4.LVDS_N2: FPGA (IC4.W17), IDC_EXT_Connectors (J13.9)
EXT4.LVDS_N3: FPGA (IC4.W22), IDC_EXT_Connectors (J13.12)
EXT4.LVDS_N4: FPGA (IC4.AB18), IDC_EXT_Connectors (J13.15)
EXT4.LVDS_N5: FPGA (IC4.AB20), IDC_EXT_Connectors (J13.18)
EXT4.LVDS_N6: FPGA (IC4.AA21), IDC_EXT_Connectors (J13.21)
EXT4.LVDS_N7: FPGA (IC4.AB22), IDC_EXT_Connectors (J13.24)
EXT4.LVDS_P0: FPGA (IC4.V18), IDC_EXT_Connectors (J13.2)
EXT4.LVDS_P1: FPGA (IC4.Y21), IDC_EXT_Connectors (J13.5)
EXT4.LVDS_P2: FPGA (IC4.V17), IDC_EXT_Connectors (J13.8)
EXT4.LVDS_P3: FPGA (IC4.W21), IDC_EXT_Connectors (J13.11)
EXT4.LVDS_P4: FPGA (IC4.AA18), IDC_EXT_Connectors (J13.14)
EXT4.LVDS_P5: FPGA (IC4.AA19), IDC_EXT_Connectors (J13.17)
EXT4.LVDS_P6: FPGA (IC4.AA20), IDC_EXT_Connectors (J13.20)
EXT4.LVDS_P7: FPGA (IC4.AB21), IDC_EXT_Connectors (J13.23)
EXT5.LVDS_N0: FPGA (IC4.K19), IDC_EXT_Connectors (J14.3)
EXT5.LVDS_N1: FPGA (IC4.H15), IDC_EXT_Connectors (J14.6)
EXT5.LVDS_N2: FPGA (IC4.K22), IDC_EXT_Connectors (J14.9)
EXT5.LVDS_N3: FPGA (IC4.M22), IDC_EXT_Connectors (J14.12)
EXT5.LVDS_N4: FPGA (IC4.G18), IDC_EXT_Connectors (J14.15)
EXT5.LVDS_N5: FPGA (IC4.J21), IDC_EXT_Connectors (J14.18)
EXT5.LVDS_N6: FPGA (IC4.L21), IDC_EXT_Connectors (J14.21)
EXT5.LVDS_N7: FPGA (IC4.K16), IDC_EXT_Connectors (J14.24)
EXT5.LVDS_P0: FPGA (IC4.K18), IDC_EXT_Connectors (J14.2)
EXT5.LVDS_P1: FPGA (IC4.J15), IDC_EXT_Connectors (J14.5)
EXT5.LVDS_P2: FPGA (IC4.K21), IDC_EXT_Connectors (J14.8)
EXT5.LVDS_P3: FPGA (IC4.N22), IDC_EXT_Connectors (J14.11)
EXT5.LVDS_P4: FPGA (IC4.G17), IDC_EXT_Connectors (J14.14)
EXT5.LVDS_P5: FPGA (IC4.J20), IDC_EXT_Connectors (J14.17)
EXT5.LVDS_P6: FPGA (IC4.M21), IDC_EXT_Connectors (J14.20)
EXT5.LVDS_P7: FPGA (IC4.L16), IDC_EXT_Connectors (J14.23)
EXT6.LVDS_N0: FPGA (IC4.H19), IDC_EXT_Connectors (J15.3)
EXT6.LVDS_N1: FPGA (IC4.H18), IDC_EXT_Connectors (J15.6)
EXT6.LVDS_N2: FPGA (IC4.G20), IDC_EXT_Connectors (J15.9)
EXT6.LVDS_N3: FPGA (IC4.J17), IDC_EXT_Connectors (J15.12)
EXT6.LVDS_N4: FPGA (IC4.H14), IDC_EXT_Connectors (J15.15)
EXT6.LVDS_N5: FPGA (IC4.H22), IDC_EXT_Connectors (J15.18)
EXT6.LVDS_N6: FPGA (IC4.G13), IDC_EXT_Connectors (J15.21)
EXT6.LVDS_N7: FPGA (IC4.G16), IDC_EXT_Connectors (J15.24)
EXT6.LVDS_P0: FPGA (IC4.J19), IDC_EXT_Connectors (J15.2)
EXT6.LVDS_P1: FPGA (IC4.H17), IDC_EXT_Connectors (J15.5)
EXT6.LVDS_P2: FPGA (IC4.H20), IDC_EXT_Connectors (J15.8)
EXT6.LVDS_P3: FPGA (IC4.K17), IDC_EXT_Connectors (J15.11)
EXT6.LVDS_P4: FPGA (IC4.J14), IDC_EXT_Connectors (J15.14)
EXT6.LVDS_P5: FPGA (IC4.J22), IDC_EXT_Connectors (J15.17)
EXT6.LVDS_P6: FPGA (IC4.H13), IDC_EXT_Connectors (J15.20)
EXT6.LVDS_P7: FPGA (IC4.G15), IDC_EXT_Connectors (J15.23)
EXT7.LVDS_N0: FPGA (IC4.D19), IDC_EXT_Connectors (J16.3)
EXT7.LVDS_N1: FPGA (IC4.G22), IDC_EXT_Connectors (J16.6)
EXT7.LVDS_N2: FPGA (IC4.F20), IDC_EXT_Connectors (J16.9)
EXT7.LVDS_N3: FPGA (IC4.F14), IDC_EXT_Connectors (J16.12)
EXT7.LVDS_N4: FPGA (IC4.E14), IDC_EXT_Connectors (J16.15)
EXT7.LVDS_N5: FPGA (IC4.D15), IDC_EXT_Connectors (J16.18)
EXT7.LVDS_N6: FPGA (IC4.E18), IDC_EXT_Connectors (J16.21)
EXT7.LVDS_N7: FPGA (IC4.E17), IDC_EXT_Connectors (J16.24)
EXT7.LVDS_P0: FPGA (IC4.E19), IDC_EXT_Connectors (J16.2)
EXT7.LVDS_P1: FPGA (IC4.G21), IDC_EXT_Connectors (J16.5)
EXT7.LVDS_P2: FPGA (IC4.F19), IDC_EXT_Connectors (J16.8)
EXT7.LVDS_P3: FPGA (IC4.F13), IDC_EXT_Connectors (J16.11)
EXT7.LVDS_P4: FPGA (IC4.E13), IDC_EXT_Connectors (J16.14)
EXT7.LVDS_P5: FPGA (IC4.D14), IDC_EXT_Connectors (J16.17)
EXT7.LVDS_P6: FPGA (IC4.F18), IDC_EXT_Connectors (J16.20)
EXT7.LVDS_P7: FPGA (IC4.F16), IDC_EXT_Connectors (J16.23)
EXT8.LVDS_N0: FPGA (IC4.C17), IDC_EXT_Connectors (J5.3)
EXT8.LVDS_N1: FPGA (IC4.A16), IDC_EXT_Connectors (J5.6)
EXT8.LVDS_N2: FPGA (IC4.A19), IDC_EXT_Connectors (J5.9)
EXT8.LVDS_N3: FPGA (IC4.B13), IDC_EXT_Connectors (J5.12)
EXT8.LVDS_N4: FPGA (IC4.C15), IDC_EXT_Connectors (J5.15)
EXT8.LVDS_N5: FPGA (IC4.D16), IDC_EXT_Connectors (J5.18)
EXT8.LVDS_N6: FPGA (IC4.A21), IDC_EXT_Connectors (J5.21)
EXT8.LVDS_N7: FPGA (IC4.D22), IDC_EXT_Connectors (J5.24)
EXT8.LVDS_P0: FPGA (IC4.D17), IDC_EXT_Connectors (J5.2)
EXT8.LVDS_P1: FPGA (IC4.A15), IDC_EXT_Connectors (J5.5)
EXT8.LVDS_P2: FPGA (IC4.A18), IDC_EXT_Connectors (J5.8)
EXT8.LVDS_P3: FPGA (IC4.C13), IDC_EXT_Connectors (J5.11)
EXT8.LVDS_P4: FPGA (IC4.C14), IDC_EXT_Connectors (J5.14)
EXT8.LVDS_P5: FPGA (IC4.E16), IDC_EXT_Connectors (J5.17)
EXT8.LVDS_P6: FPGA (IC4.B21), IDC_EXT_Connectors (J5.20)
EXT8.LVDS_P7: FPGA (IC4.E22), IDC_EXT_Connectors (J5.23)
EXT9.LVDS_N0: FPGA (IC4.C19), IDC_EXT_Connectors (J6.3)
EXT9.LVDS_N1: FPGA (IC4.A14), IDC_EXT_Connectors (J6.6)
EXT9.LVDS_N2: FPGA (IC4.A20), IDC_EXT_Connectors (J6.9)
EXT9.LVDS_N3: FPGA (IC4.B16), IDC_EXT_Connectors (J6.12)
EXT9.LVDS_N4: FPGA (IC4.C20), IDC_EXT_Connectors (J6.15)
EXT9.LVDS_N5: FPGA (IC4.B18), IDC_EXT_Connectors (J6.18)
EXT9.LVDS_N6: FPGA (IC4.B22), IDC_EXT_Connectors (J6.21)
EXT9.LVDS_N7: FPGA (IC4.D21), IDC_EXT_Connectors (J6.24)
EXT9.LVDS_P0: FPGA (IC4.C18), IDC_EXT_Connectors (J6.2)
EXT9.LVDS_P1: FPGA (IC4.A13), IDC_EXT_Connectors (J6.5)
EXT9.LVDS_P2: FPGA (IC4.B20), IDC_EXT_Connectors (J6.8)
EXT9.LVDS_P3: FPGA (IC4.B15), IDC_EXT_Connectors (J6.11)
EXT9.LVDS_P4: FPGA (IC4.D20), IDC_EXT_Connectors (J6.14)
EXT9.LVDS_P5: FPGA (IC4.B17), IDC_EXT_Connectors (J6.17)
EXT9.LVDS_P6: FPGA (IC4.C22), IDC_EXT_Connectors (J6.20)
EXT9.LVDS_P7: FPGA (IC4.E21), IDC_EXT_Connectors (J6.23)
EXT10.LVDS_N0: FPGA (IC4.V15), IDC_EXT_Connectors (J7.3)
EXT10.LVDS_N1: FPGA (IC4.AA16), IDC_EXT_Connectors (J7.6)
EXT10.LVDS_N2: FPGA (IC4.AB17), IDC_EXT_Connectors (J7.9)
EXT10.LVDS_N3: FPGA (IC4.AB15), IDC_EXT_Connectors (J7.12)
EXT10.LVDS_N4: FPGA (IC4.AA14), IDC_EXT_Connectors (J7.15)
EXT10.LVDS_N5: FPGA (IC4.AB13), IDC_EXT_Connectors (J7.18)
EXT10.LVDS_N6: FPGA (IC4.W12), IDC_EXT_Connectors (J7.21)
EXT10.LVDS_N7: FPGA (IC4.AB12), IDC_EXT_Connectors (J7.24)
EXT10.LVDS_P0: FPGA (IC4.U15), IDC_EXT_Connectors (J7.2)
EXT10.LVDS_P1: FPGA (IC4.Y16), IDC_EXT_Connectors (J7.5)
EXT10.LVDS_P2: FPGA (IC4.AB16), IDC_EXT_Connectors (J7.8)
EXT10.LVDS_P3: FPGA (IC4.AA15), IDC_EXT_Connectors (J7.11)
EXT10.LVDS_P4: FPGA (IC4.Y13), IDC_EXT_Connectors (J7.14)
EXT10.LVDS_P5: FPGA (IC4.AA13), IDC_EXT_Connectors (J7.17)
EXT10.LVDS_P6: FPGA (IC4.W11), IDC_EXT_Connectors (J7.20)
EXT10.LVDS_P7: FPGA (IC4.AB11), IDC_EXT_Connectors (J7.23)
EXT11.LVDS_N0: FPGA (IC4.Y12), IDC_EXT_Connectors (J17.3)
EXT11.LVDS_N1: FPGA (IC4.T15), IDC_EXT_Connectors (J17.6)
EXT11.LVDS_N2: FPGA (IC4.W16), IDC_EXT_Connectors (J17.9)
EXT11.LVDS_N3: FPGA (IC4.Y14), IDC_EXT_Connectors (J17.12)
EXT11.LVDS_N4: FPGA (IC4.V14), IDC_EXT_Connectors (J17.15)
EXT11.LVDS_N5: FPGA (IC4.W10), IDC_EXT_Connectors (J17.18)
EXT11.LVDS_N6: FPGA (IC4.AA11), IDC_EXT_Connectors (J17.21)
EXT11.LVDS_N7: FPGA (IC4.AB10), IDC_EXT_Connectors (J17.24)
EXT11.LVDS_P0: FPGA (IC4.Y11), IDC_EXT_Connectors (J17.2)
EXT11.LVDS_P1: FPGA (IC4.T14), IDC_EXT_Connectors (J17.5)
EXT11.LVDS_P2: FPGA (IC4.W15), IDC_EXT_Connectors (J17.8)
EXT11.LVDS_P3: FPGA (IC4.W14), IDC_EXT_Connectors (J17.11)
EXT11.LVDS_P4: FPGA (IC4.V13), IDC_EXT_Connectors (J17.14)
EXT11.LVDS_P5: FPGA (IC4.V10), IDC_EXT_Connectors (J17.17)
EXT11.LVDS_P6: FPGA (IC4.AA10), IDC_EXT_Connectors (J17.20)
EXT11.LVDS_P7: FPGA (IC4.AA9), IDC_EXT_Connectors (J17.23)
GPIO_INT0: FPGA (IC4.U18), FPGA_I2C (IC25.20 IC29.1)
GPIO_INT1: FPGA (IC4.R17), FPGA_I2C (IC24.20 IC28.1)
Helper_DCXO_N: FPGA (IC4.W20), ClockRecovery (OSC3.5)
Helper_DCXO_OE: ClockRecovery (IC12.9 R245.1 R247.2), FPGA_I2C (IC24.7 IC28.19)
Helper_DCXO_P: FPGA (IC4.W19), ClockRecovery (R225.2)
Helper_DCXO_SCL: FPGA (IC4.N13), ClockRecovery (OSC3.8 R50.1 TP24.1)
Helper_DCXO_SDA: FPGA (IC4.N15), ClockRecovery (OSC3.7 R41.1 TP23.1)
HW_REV0: FPGA (IC4.T16), FPGA_I2C (R267.1)
HW_REV1: FPGA (IC4.U16), FPGA_I2C (R268.1)
HW_REV2: FPGA (IC4.T3), FPGA_I2C (R269.1)
HW_REV3: FPGA (IC4.F21), FPGA_I2C (R270.1)
I2C_3V3_SW_SCL: FPGA_I2C (IC13.6 IC14.19 IC15.19 R149.1), USB_Serial_Quad (IC22.3 TP19.1)
I2C_3V3_SW_SDA: FPGA_I2C (IC13.5 IC14.20 IC15.20 R148.1), USB_Serial_Quad (IC22.4 TP18.1)
I2C_SCL_0: FPGA_I2C (IC14.17 R156.1), IDC_EXT_Connectors (D3.3 J9.27)
I2C_SCL_1: FPGA_I2C (IC14.13 R158.1), IDC_EXT_Connectors (D4.3 J10.27)
I2C_SCL_2: FPGA_I2C (IC14.11 R160.1), IDC_EXT_Connectors (D5.3 J11.27)
I2C_SCL_3: FPGA_I2C (IC14.8 R162.1), IDC_EXT_Connectors (D6.3 J12.27)
I2C_SCL_4: FPGA_I2C (IC14.6 R164.1), IDC_EXT_Connectors (D7.3 J13.27)
I2C_SCL_5: FPGA_I2C (IC14.4 R166.1), IDC_EXT_Connectors (D8.3 J14.27)
I2C_SCL_6: FPGA_I2C (IC14.2 R168.1), IDC_EXT_Connectors (D9.3 J15.27)
I2C_SCL_7: FPGA_I2C (IC14.15 R170.1), IDC_EXT_Connectors (D10.3 J16.27)
I2C_SCL_8: FPGA_I2C (IC15.11 R172.1), IDC_EXT_Connectors (D11.3 J5.27)
I2C_SCL_9: FPGA_I2C (IC15.13 R175.1), IDC_EXT_Connectors (D13.3 J6.27)
I2C_SCL_10: FPGA_I2C (IC15.17 R178.1), IDC_EXT_Connectors (D12.3 J7.27)
I2C_SCL_11: FPGA_I2C (IC15.15 R182.1), IDC_EXT_Connectors (D14.3 J17.27)
I2C_SDA_0: FPGA_I2C (IC14.16 R155.1), IDC_EXT_Connectors (D3.2 J9.26)
I2C_SDA_1: FPGA_I2C (IC14.12 R157.1), IDC_EXT_Connectors (D4.2 J10.26)
I2C_SDA_2: FPGA_I2C (IC14.10 R159.1), IDC_EXT_Connectors (D5.2 J11.26)
I2C_SDA_3: FPGA_I2C (IC14.7 R161.1), IDC_EXT_Connectors (D6.2 J12.26)
I2C_SDA_4: FPGA_I2C (IC14.5 R163.1), IDC_EXT_Connectors (D7.2 J13.26)
I2C_SDA_5: FPGA_I2C (IC14.3 R165.1), IDC_EXT_Connectors (D8.2 J14.26)
I2C_SDA_6: FPGA_I2C (IC14.1 R167.1), IDC_EXT_Connectors (D9.2 J15.26)
I2C_SDA_7: FPGA_I2C (IC14.14 R169.1), IDC_EXT_Connectors (D10.2 J16.26)
I2C_SDA_8: FPGA_I2C (IC15.10 R171.1), IDC_EXT_Connectors (D11.2 J5.26)
I2C_SDA_9: FPGA_I2C (IC15.12 R173.1), IDC_EXT_Connectors (D13.2 J6.26)
I2C_SDA_10: FPGA_I2C (IC15.16 R176.1), IDC_EXT_Connectors (D12.2 J7.26)
I2C_SDA_11: FPGA_I2C (IC15.14 R180.1), IDC_EXT_Connectors (D14.2 J17.26)
I2C_SW_RESET: FPGA (IC4.U17), FPGA_I2C (R33.2 T21.1)
I2C_SW_RESET2: FPGA_I2C (R46.2 T22.1), USB_Serial_Quad (IC18.27)
I2C_SW_SCL: FPGA (IC4.J16), FPGA_I2C (IC13.3 R147.1 TP14.1)
I2C_SW_SDA: FPGA (IC4.M17), FPGA_I2C (IC13.4 R146.1 TP13.1)
Main_DCXO_OE: ClockRecovery (IC12.8 R244.1 R246.2), FPGA_I2C (IC24.28 IC28.11)
Main_DCXO_SCL: FPGA (IC4.U7), ClockRecovery (OSC1.8 R35.1 TP22.1)
Main_DCXO_SDA: FPGA (IC4.N14), ClockRecovery (OSC1.7 R34.1 TP21.1)
NetC53_2: FPGAPower&Misc (C53.2 J8.13 R58.1), USB_Serial_Quad (T13.1)
P3V3_EEM_EN: FPGA (NT1.2), PowerSupplies (IC32.2 R260.2)
P3V3_EEM_FLT_N: FPGA (NT2.2), PowerSupplies (IC32.6)
RESETn: PowerSupplies (IC6.20 R51.1 T6.1 TP5.1), FPGAPower&Misc (R53.1)
RxD_2V5: FPGA (IC4.P17), USB_Serial_Quad (IC20.5 TP16.1)
SFP0_RD_N: SFP (J19.LB12), FPGAGTP (IC4.A8)
SFP0_RD_P: SFP (J19.LB13), FPGAGTP (IC4.B8)
SFP0_TD_N: SFP (J19.LB19), FPGAGTP (IC4.A4)
SFP0_TD_P: SFP (J19.LB18), FPGAGTP (IC4.B4)
SFP1_RD_N: SFP (J19.LT12), FPGAGTP (IC4.C11)
SFP1_RD_P: SFP (J19.LT13), FPGAGTP (IC4.D11)
SFP1_TD_N: SFP (J19.LT19), FPGAGTP (IC4.C5)
SFP1_TD_P: SFP (J19.LT18), FPGAGTP (IC4.D5)
SFP2_RD_N: SFP (J19.RB12), FPGAGTP (IC4.A10)
SFP2_RD_P: SFP (J19.RB13), FPGAGTP (IC4.B10)
SFP2_TD_N: SFP (J19.RB19), FPGAGTP (IC4.A6)
SFP2_TD_P: SFP (J19.RB18), FPGAGTP (IC4.B6)
SFP3_RD_N: SFP (J19.RT12), FPGAGTP (IC4.C9)
SFP3_RD_P: SFP (J19.RT13), FPGAGTP (IC4.D9)
SFP3_TD_N: SFP (J19.RT19), FPGAGTP (IC4.C7)
SFP3_TD_P: SFP (J19.RT18), FPGAGTP (IC4.D7)
SFP_3.SCL: SFP (J19.RT5), FPGA_I2C (R235.2)
SFP_3.SDA: SFP (J19.RT4), FPGA_I2C (R234.2)
SHARED_SCL: ClockRecovery (R237.1), FPGA_I2C (7 pins)
SHARED_SDA: ClockRecovery (R236.1), FPGA_I2C (7 pins)
TxD_2V5: FPGA (IC4.P16), USB_Serial_Quad (IC20.4 TP17.1)

## Assembly variants
Si549 CMOS: not fitted C189 C203 C227 C294 C295 C303 C304 C307 D19 IC27 IC28 IC29 IC30 IC31 J24 J26 R9 R13 R36 R39 R40 R43 R47 R48 R80 R97 R152 R153 R177 R181 R192 R212 R221 R238 R239 R242 R246 R247 R257 R264 R265 R271
Si549 LVDS: not fitted C203 C227 C294 C295 C303 C304 C307 D19 IC27 IC28 IC29 IC30 IC31 J24 J26 R9 R13 R38 R39 R40 R43 R47 R48 R80 R98 R152 R153 R177 R181 R192 R212 R221 R224 R238 R239 R242 R246 R247 R257 R264 R265 R272; alternate parts OSC1 -> OSC_0.2-800MHZ_SILICON-LAB_549BACB001937ABG, R37 -> R0402_0R_JUMPER, OSC3 -> OSC_0.2-800MHZ_SILICON-LAB_549BACB001937ABG, R225 -> R0402_0R_JUMPER